# Altium schematic sheet PowerMeasure.SchDoc
size 218 x 162 mm; PageSetup: Record=PageOptions|CenterHorizontal=True|CenterVertical=True|PrintScale=1.22|XCorrection=1.00|YCorrection=1.00|PrintKind=2|BorderSize=5000000|LeftOffset=0|BottomOffset=0|Orientation=2|PaperLength=1000|PaperWidth=1000|Scale=100|PaperSource=7|PrintQuality=-4|MediaType=1|DitherType=10|PaperKind=A4|PrintScaleMode=1
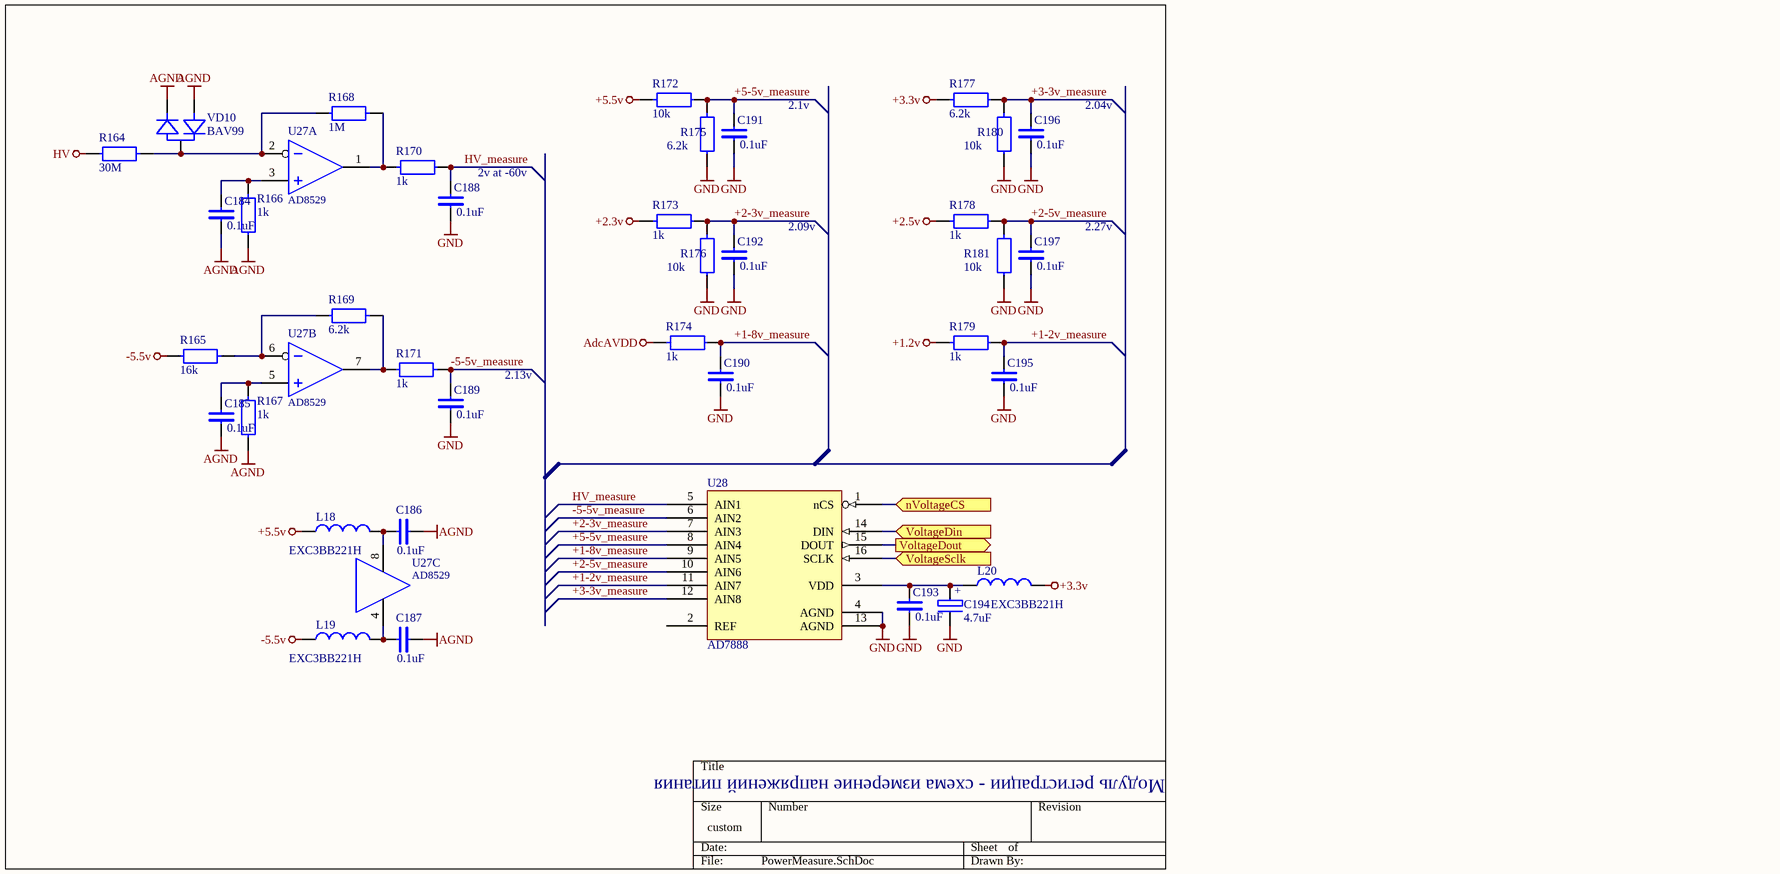
[diagram p0: PowerMeasure.SchDoc]

## Parts
C184  0.1uF  [0603]
C185  0.1uF  [0603]
C186  0.1uF  [0603]
C187  0.1uF  [0603]
C188  0.1uF  [0603]
C189  0.1uF  [0603]
C190  0.1uF  [0603]
C191  0.1uF  [0603]
C192  0.1uF  [0603]
C193  0.1uF  [0603]
C194  4.7uF  [CP3216]
C195  0.1uF  [0603]
C196  0.1uF  [0603]
C197  0.1uF  [0603]
L18  EXC3BB221H  [0603]
L19  EXC3BB221H  [0603]
L20  EXC3BB221H  [0603]
R164  30M  [0805]
R165  16k  [0805]
R166  1k  [0603]
R167  1k  [0603]
R168  1M  [0805]
R169  6.2k  [0805]
R170  1k  [0603]
R171  1k  [0603]
R172  10k  [0603]
R173  1k  [0603]
R174  1k  [0603]
R175  6.2k  [0805]
R176  10k  [0603]
R177  6.2k  [0805]
R178  1k  [0603]
R179  1k  [0603]
R180  10k  [0603]
R181  10k  [0603]
U27  AD8529  [8SOIC150]  (parts A,B,C of 3)
U28  AD7888  [16SOIC150]
VD10  BAV99  [SOT-23]

## Ports
nVoltageCS (in), VoltageDin (in), VoltageDout (out), VoltageSclk (in)

## Nets
+1.2v: R179.2
+2.3v: R173.2
+2.5v: R178.2
+3.3v: L20.2 R177.2
+5.5v: L18.1 R172.2
-5.5v: L19.1 R165.1
AdcAVDD: R174.2
AGND: C184.1 C185.1 C186.1 C187.1 R166.1 R167.1 VD10.1 VD10.2
GND: C188.1 C189.1 C190.1 C191.1 C192.1 C193.1 C194.- C195.1 C196.1 C197.1 R175.1 R176.1 R180.1 R181.1 U28.4(AGND) U28.13(AGND)
HV: R164.1
+1-2v_measure: C195.2 R179.1 U28.11(AIN7)
+1-8v_measure: C190.2 R174.1 U28.9(AIN5)
+2-3v_measure: C192.2 R173.1 R176.2 U28.7(AIN3)
+2-5v_measure: C197.2 R178.1 R181.2 U28.10(AIN6)
+3-3v_measure: C196.2 R177.1 R180.2 U28.12(AIN8)
+5-5v_measure: C191.2 R172.1 R175.2 U28.8(AIN4)
-5-5v_measure: C189.2 R171.2 U28.6(AIN2)
HV_measure: C188.2 R170.1 U28.5(AIN1)
nVoltageCS: U28.1(nCS) ; port nVoltageCS
VoltageDin: U28.14(DIN) ; port VoltageDin
VoltageDout: U28.15(DOUT) ; port VoltageDout
VoltageSclk: U28.16(SCLK) ; port VoltageSclk
NetC184_2: C184.2 R166.2 U27.3(IN+)
NetC185_2: C185.2 R167.2 U27.5(IN+)
NetC186_2: C186.2 L18.2 U27.8(V+)
NetC187_2: C187.2 L19.2 U27.4(V-)
NetC193_2: C193.2 C194.+ L20.1 U28.3(VDD)
NetR164_2: R164.2 R168.1 U27.2(IN-) VD10.3
NetR165_2: R165.2 R169.1 U27.6(IN-)
NetR168_2: R168.2 R170.2 U27.1(OUT)
NetR169_2: R169.2 R171.1 U27.7(OUT)

Not connected (* = marked no-connect by the designer): U28 2(REF)

## Notes on the sheet
- 2.1v
- 2.04v
- 2v at -60v
- 2.09v
- 2.27v
- 2.13v
- Модуль регистрации - схема измерение напряжений питания

## Library data of the parts
C184 C185 C188-C193 C195-C197 = C
C186 C187 = c
C194 = C POL
L18-L20 = INDUCTOR
R164-R169 = r
R170-R181 = R
U27 = AD8529: 8 MHz Rail-to-Rail Operational Amplifiers; Value: AD8529
U28 = AD7888: 8-Channel, 125 kSPS, 12-Bit ADC; BodyName: *; Instance: *; PartName: *; PLACEMENT_REGION: *; CompValue: *; Right: *; Bottom: *; SymName: *; RefLocation: *; BoardLocation: *; SlotXofY: *
VD10 = BAV99: Double diode